# EAGLE schematic esquematico_pic_esp8266 (EAGLE 6.1)
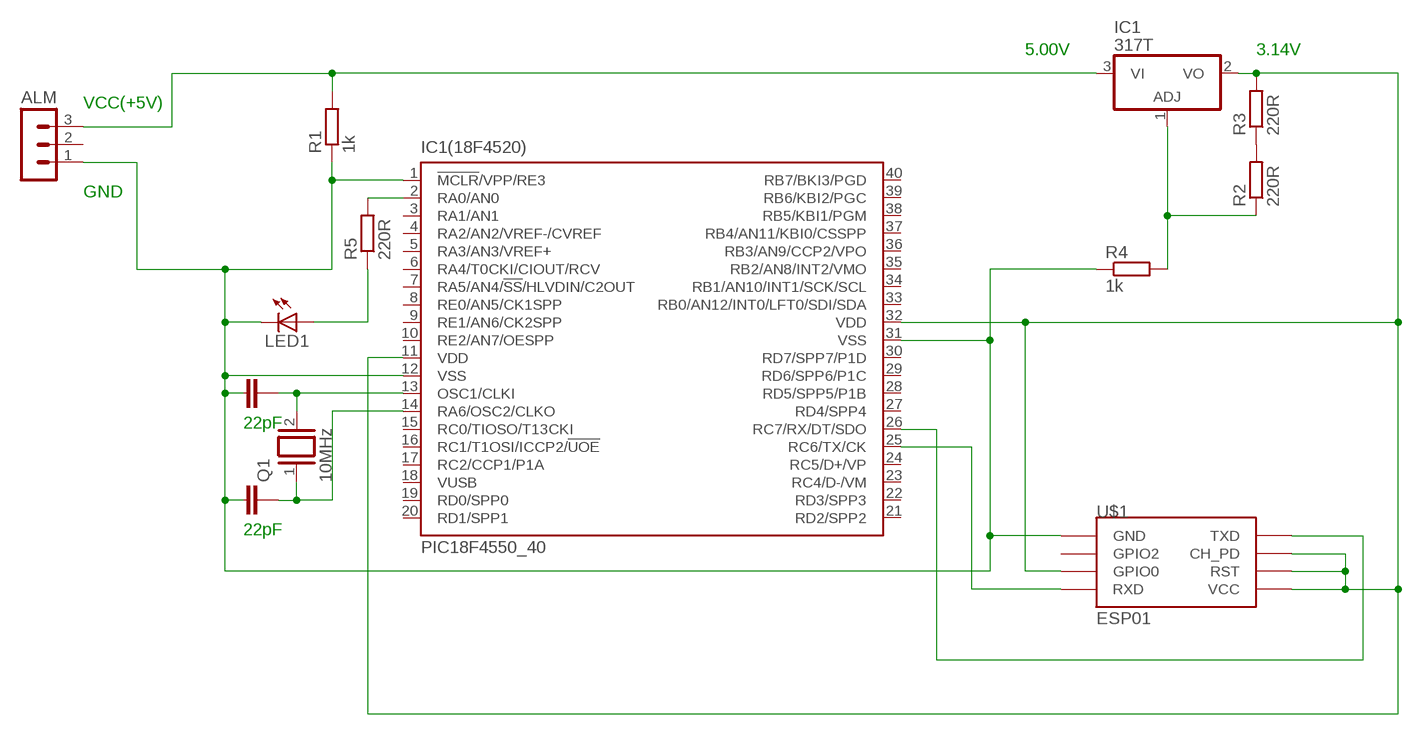
[diagram p0: schematic, sheet 1]

## Parts
ALM  MA03-1  [MA03-1]
IC1  317T  [TO220H]
IC1(18F4520)  PIC18F4550_40  [DIL40]
LED1  LED3MM  [LED3MM]
Q1  10MHz  XTAL  [Q]
R1  1k  R-EU_0207/10  [0207/10]
R2  220R  R-EU_0207/10  [0207/10]
R3  220R  R-EU_0207/10  [0207/10]
R4  1k  R-EU_0207/10  [0207/10]
R5  220R  R-EU_0207/10  [0207/10]
U$1  ESP01  [ESP01]

## Nets
N$1: LED1.A R5.1
N$2: ALM.3 IC1.3(VI) R1.2
N$3: ALM.1 IC1(18F4520).1(!MCLR!/VPP/RE3) IC1(18F4520).12(VSS) IC1(18F4520).31(VSS) LED1.K(C) R1.1 R4.1 U$1.GND
N$4: IC1(18F4520).2(RA0/AN0) R5.2
N$6: IC1(18F4520).13(OSC1/CLKI) Q1.2
N$7: IC1(18F4520).14(RA6/OSC2/CLKO) Q1.1
N$8: IC1(18F4520).11(VDD) IC1(18F4520).32(VDD) IC1.2(VO) R3.2 U$1.CH_PD U$1.GPIO0 U$1.RST U$1.VCC
N$9: IC1.1(ADJ) R2.1 R4.2
N$11: R2.2 R3.1
N$15: IC1(18F4520).25(RC6/TX/CK) U$1.RX(RXD)
N$16: IC1(18F4520).26(RC7/RX/DT/SDO) U$1.TX(TXD)
Unconnected: ALM.2 IC1(18F4520).3(RA1/AN1) IC1(18F4520).4(RA2/AN2/VREF-/CVREF) IC1(18F4520).5(RA3/AN3/VREF+) IC1(18F4520).6(RA4/T0CKI/CIOUT/RCV) IC1(18F4520).7(RA5/AN4/!SS!/HLVDIN/C2OUT) IC1(18F4520).8(RE0/AN5/CK1SPP) IC1(18F4520).9(RE1/AN6/CK2SPP) IC1(18F4520).10(RE2/AN7/OESPP) IC1(18F4520).15(RC0/TIOSO/T13CKI) IC1(18F4520).16(RC1/T1OSI/ICCP2/!UOE) IC1(18F4520).17(RC2/CCP1/P1A) IC1(18F4520).18(VUSB) IC1(18F4520).19(RD0/SPP0) IC1(18F4520).20(RD1/SPP1) IC1(18F4520).21(RD2/SPP2) IC1(18F4520).22(RD3/SPP3) IC1(18F4520).23(RC4/D-/VM) IC1(18F4520).24(RC5/D+/VP) IC1(18F4520).27(RD4/SPP4) IC1(18F4520).28(RD5/SPP5/P1B) IC1(18F4520).29(RD6/SPP6/P1C) IC1(18F4520).30(RD7/SPP7/P1D) IC1(18F4520).33(RB0/AN12/INT0/LFT0/SDI/SDA) IC1(18F4520).34(RB1/AN10/INT1/SCK/SCL) IC1(18F4520).35(RB2/AN8/INT2/VMO) IC1(18F4520).36(RB3/AN9/CCP2/VPO) IC1(18F4520).37(RB4/AN11/KBI0/CSSPP) IC1(18F4520).38(RB5/KBI1/PGM) IC1(18F4520).39(RB6/KBI2/PGC) IC1(18F4520).40(RB7/BKI3/PGD) U$1.GPIO2

## Notes on the sheet
- 5.00V | 3.14V
- VCC(+5V)
- GND
- 22pF
- 22pF

## Library data of the parts
ALM = con-lstb:MA03-1: PIN HEADER; OC_FARNELL: unknown; OC_NEWARK: unknown
IC1 = linear:*317: Positive VOLTAGE REGULATOR
IC1(18F4520) = microchip:PIC18F4*_40: USB Microcontrollers with nanoWatt Technology High-Performance, Enhanced Flash, 28/40/44-Pin, Source: http://ww1.microchip.com/downloads/en/devicedoc/39632c.pdf; MF: MICROCHIP; MPN: PIC18F4550-I/P; OC_FARNELL: 9321357; OC_NEWARK: 74K8623
LED1 = led:LED: LED OSRAM: - CHIPLED LG R971, LG N971, LY N971, LG Q971, LY Q971, LO R971, LY R971 LH N974, LH R974 LS Q976, LO Q976, LY Q976 LO Q996 - Hyper CHIPLED LW Q18S LB Q993, LB Q99A, LB R99A - SideLED LS A670, LO A670, LY A670, LG A670, LP A670 LB A673, LV A673, LT A673, LW A673 LH A674 LY A675 LS A676, LA A676, LO A676, LY A676, LW A676 LS A679, LY A679, LG A679 - Hyper Micro SIDELED® LS Y876, LA Y876, LO Y876, LY Y876 LT Y87S - SmartLED LW L88C, LW L88S LB L89C, LB L89S, LG L890 LS L89K, LO L89K, LY L89K LS L896, LA L896, LO L896, LY L896 - TOPLED LS T670, LO T670, LY T670, LG T670, LP T670 LSG T670, LSP T670, LSY T670, LOP T670, LYG T670 LG T671, LOG T671, LSG T671 LB T673, LV T673, LT T673, LW T673 LH T674 LS T676, LA T676, LO T676, LY T676, LB T676, LH T676, LSB T676, LW T676 LB T67C, LV T67C, LT T67C, LS T67K, LO T67K, LY T67K, LW E67C LS E67B, LA E67B, LO E67B, LY E67B, LB E67C, LV E67C, LT E67C LW T67C LS T679, LY T679, LG T679 LS T770, LO T770, LY T770, LG T770, LP T770 LB T773, LV T773, LT T773, LW T773 LH T774 LS E675, LA E675, LY E675, LS T675 LS T776, LA T776, LO T776, LY T776, LB T776 LHGB T686 LT T68C, LB T68C - Hyper Mini TOPLED® LB M676 - Mini TOPLED Santana® LG M470 LS M47K, LO M47K, LY M47K Source: http://www.osram.convergy.de LUXEON: - LUMILED® LXK2-PW12-R00, LXK2-PW12-S00, LXK2-PW14-U00, LXK2-PW14-V00 LXK2-PM12-R00, LXK2-PM12-S00, LXK2-PM14-U00 LXK2-PE12-Q00, LXK2-PE12-R00, LXK2-PE12-S00, LXK2-PE14-T00, LXK2-PE14-U00 LXK2-PB12-K00, LXK2-PB12-L00, LXK2-PB12-M00, LXK2-PB14-N00, LXK2-PB14-P00, LXK2-PB14-Q00 LXK2-PR12-L00, LXK2-PR12-M00, LXK2-PR14-Q00, LXK2-PR14-R00 LXK2-PD12-Q00, LXK2-PD12-R00, LXK2-PD12-S00 LXK2-PH12-R00, LXK2-PH12-S00 LXK2-PL12-P00, LXK2-PL12-Q00, LXK2-PL12-R00 Source: www.luxeon.com KINGBRIGHT: KA-3528ASYC Source: www.kingbright.com
Q1 = special:XTAL: CRYSTAL
R1-R5 = resistor:R-EU_: RESISTOR, European symbol
U$1 = esp8266modules:ESP01: ESP8266 Wifi module 01